# Altium project Current Loop.PrjPcb
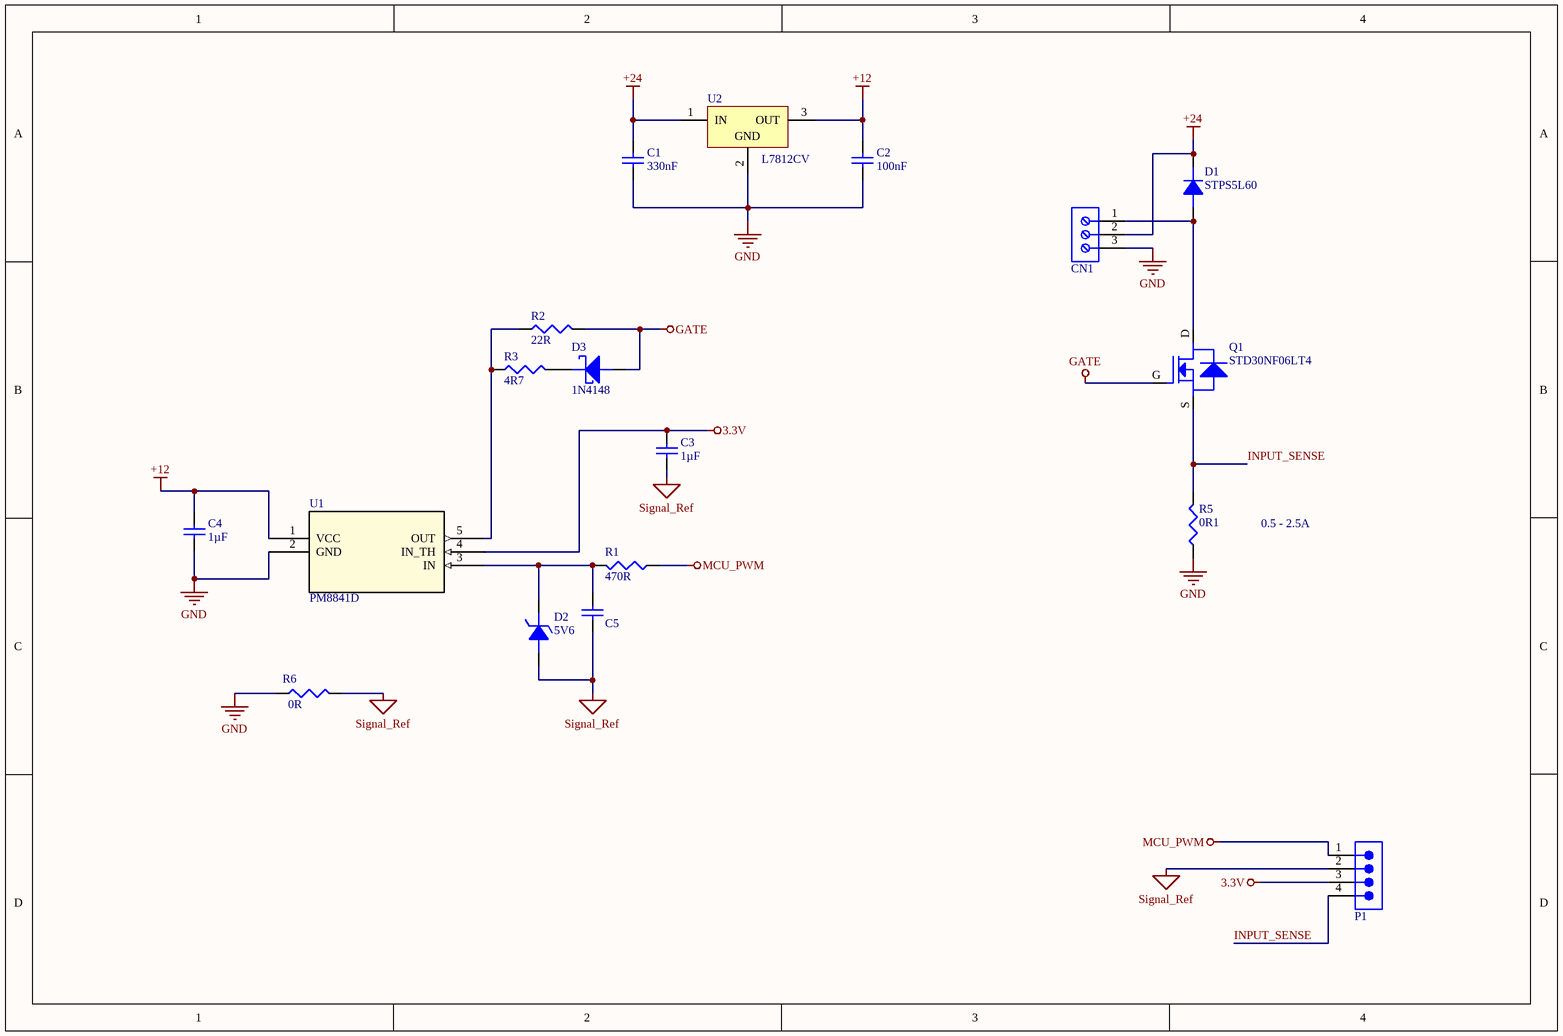
[diagram p0: Current Loop.SchDoc]
1 sheet, 18 parts. Net scope: global (net labels, ports and power ports of the same name join across sheets).
Board file: Current Loop PM8841.PcbDoc

## Sheet Current Loop.SchDoc
size A4

### Parts
C1  330nF  [WCAP-CSGP_0805_L2W1.25H1.25]
C2  100nF  [WCAP-CSGP_0805_L2W1.25H0.8_Reflow]
C3  1µF  [WCAP-CSGP_0805_L2W1.25H1.25]
C4  1µF  [WCAP-CSGP_0805_L2W1.25H1.25]
C5  47pF  [WCAP-CSGP_0805_L2W1.25H0.6_Reflow]  (value not drawn)
CN1  691216710003  [691216710003]  (value not drawn)
D1  STPS5L60  [SMB]
D2  5V6  [SOD80]
D3  1N4148  [SMA]
P1  61300411121  [61300411121]  (value not drawn)
Q1  STD30NF06LT4  [NFET_DPAK]
R1  470R  [SM/R_0805]
R2  22R  [SM/R_0805]
R3  4R7  [SM/R_0805]
R5  0R1  [SM/R_2512]
R6  0R  [SM/R_0805]
U1  PM8841D  [SOT23-5_STM]
U2  L7812CV  [TO220]

### Nets
3.3V: C3.2 P1.3 U1.4(IN_TH)
+12: C2.2 C4.2 U1.1(VCC) U2.3(OUT)
+24: C1.2 CN1.2 D1.K(CATHODE) U2.1(IN)
GATE: D3.A Q1.G(GATE) R2.2
GND: C1.1 C2.1 C4.1 CN1.3 R5.1 R6.1 U1.2(GND) U2.2(GND)
MCU_PWM: P1.1 R1.1
Signal_Ref: C3.1 C5.1 D2.A(ANODE) P1.2 R6.2
INPUT_SENSE: P1.4 Q1.S(SOURCE) R5.2
NetC5_2: C5.2 D2.K(CATHODE) R1.2 U1.3(IN)
NetCN1_1: CN1.1 D1.A(ANODE) Q1.D(DRAIN)
NetD3_K: D3.K R3.2
NetR2_1: R2.1 R3.1 U1.5(OUT)

### Notes on the sheet
- 0.5 - 2.5A

### Library data of the parts
C1 = 885012207101: WCAP-CSGP Multilayer Ceramic Chip Capacitor, General Purpose, size 0805, X7R, 330nF, 50VDC; Manufacturer: Wurth Elektronik; Case/Size Code: 0805; Capacitance Tolerance: +/-10%; Dissipation Factor: 3%; Insulation Resistance: 1.5GΩ; Rated Voltage (DC): 50V; Technical Reference: X7R0805334K050DFCT10000; Manufacturer Part Number: 885012207101; Category: Multilayer Ceramic Chip Capacitors; Match Code: WCAP-CSGP; ComponentLink1Description: Website Link; ComponentLink1URL: https://www.we-online.com/redexpert/article/885012207101?ad; ComponentLink2Description: Datasheet Link; ComponentLink2URL: https://www.we-online.com/redexpert/spec/885012207101?ad; Mount: Surface Mount; Operating Temperature Max: 125°C; Operating Temperature Min: -55°C; Packaging: Tape and Reel; Length: 2mm; Width: 1.25mm; Height: 1.25mm; Capacitance: 330nF; Ceramic Type: X7R
C2 = 885012207072: WCAP-CSGP Multilayer Ceramic Chip Capacitor, General Purpose, size 0805, X7R, 100nF, 25VDC; Manufacturer: Wurth Elektronik; Case/Size Code: 0805; Capacitance Tolerance: +/-10%; Dissipation Factor: 3.5%; Insulation Resistance: 5GΩ; Rated Voltage (DC): 25V; Technical Reference: X7R0805104K025DFCT10000; Manufacturer Part Number: 885012207072; Category: Multilayer Ceramic Chip Capacitors; Match Code: WCAP-CSGP; ComponentLink1Description: Website Link; ComponentLink1URL: https://www.we-online.com/redexpert/article/885012207072?ad; ComponentLink2Description: Datasheet Link; ComponentLink2URL: https://www.we-online.com/redexpert/spec/885012207072?ad; Mount: Surface Mount; Operating Temperature Max: 125°C; Operating Temperature Min: -55°C; Packaging: Tape and Reel; Length: 2mm; Width: 1.25mm; Height: 0.8mm; Capacitance: 100nF; Ceramic Type: X7R
C3 C4 = 885012207078: WCAP-CSGP Multilayer Ceramic Chip Capacitor, General Purpose, size 0805, X7R, 1µF, 25VDC; Manufacturer: Wurth Elektronik; Case/Size Code: 0805; Capacitance Tolerance: +/-10%; Dissipation Factor: 5%; Insulation Resistance: 0.5GΩ; Rated Voltage (DC): 25V; Technical Reference: X7R0805105K025DFCT10000; Manufacturer Part Number: 885012207078; Category: Multilayer Ceramic Chip Capacitors; Match Code: WCAP-CSGP; ComponentLink1Description: Website Link; ComponentLink1URL: https://www.we-online.com/redexpert/article/885012207078?ad; ComponentLink2Description: Datasheet Link; ComponentLink2URL: https://www.we-online.com/redexpert/spec/885012207078?ad; Mount: Surface Mount; Operating Temperature Max: 125°C; Operating Temperature Min: -55°C; Packaging: Tape and Reel; Length: 2mm; Width: 1.25mm; Height: 1.25mm; Capacitance: 1µF; Ceramic Type: X7R
C5 = 885012007032: WCAP-CSGP Multilayer Ceramic Chip Capacitor, General Purpose, size 0805, NP0, 47pF, 25VDC; Manufacturer: Wurth Elektronik; Case/Size Code: 0805; Capacitance Tolerance: +/-5%; Insulation Resistance: 10GΩ; Q Factor: 1000; Rated Voltage (DC): 25V; Technical Reference: NP00805470J025DFCT10000; Manufacturer Part Number: 885012007032; Category: Multilayer Ceramic Chip Capacitors; Match Code: WCAP-CSGP; ComponentLink1Description: Website Link; ComponentLink1URL: https://www.we-online.com/redexpert/article/885012007032?ad; ComponentLink2Description: Datasheet Link; ComponentLink2URL: https://www.we-online.com/redexpert/spec/885012007032?ad; Mount: Surface Mount; Operating Temperature Max: 125°C; Operating Temperature Min: -55°C; Packaging: Tape and Reel; Length: 2mm; Width: 1.25mm; Height: 0.6mm; Capacitance: 47pF; Ceramic Type: NP0
CN1 = 691216710003: WR-TBL Serie 2167 Horizontal Entry Modular, Rising Cage Clamp, pitch 5mm, 3p; Compliance: Lead free / RoHS;​ ROHS & Reach; Modularity: Yes; PCB/Cable/Panel: PCB; Pin Number: 3; Rated Current [UL]: 14A; Working Voltage [UL]: 300VAC; ComponentLink1Description: Manufacturer; ComponentLink1URL: http://www.we-online.de; ComponentLink2URL: https://katalog.we-online.de/em/datasheet/691216710003.pdf; ComponentLink2Description: Datasheet; Mounting Technology: THT; Part Number: 691216710003; Packaging: Box; Operating Temperature: -30 to +120degC; Pitch: 5mm; Published Date: October 2019; Type: Horizontal; Publisher: Wurth Elektronik; Application: Rising Cage Clamp
D1 = SMB: Manufacturer: STMicroelectronics
D2 = SOD80_zener
D3 = SMA_Schottky: Value/Generic Part Number: Schottky Diode; Package/Class: SM
P1 = 61300411121: WR-PHD Pin Header, THT, Vertical, pitch 2.54mm, 1 Row, 4P; Manufacturer: Wurth Elektronik; Contact Resistance: 20mΩ; Rated Current: 3A; Working Voltage: 250V; Withstanding Voltage: 500V; ComponentLink1Description: Website Link; ComponentLink1URL: https://www.we-online.com/redexpert/article/61300411121?ad; ComponentLink2Description: Datasheet Link; ComponentLink2URL: https://www.we-online.com/redexpert/spec/61300411121?ad; Manufacturer Part Number: 61300411121; Category: Board-to-Board Connectors; Match Code: WR-PHD; Mount: Through Hole; Operating Temperature Max: 105°C; Operating Temperature Min: -40°C; Packaging: Bag; Gender: Pin Header; Number of Pins: 4; Number of Rows: 1; Orientation: Vertical; Pitch: 2.54mm
Q1 = NFET: Manufacturer: STMicroelectronics; Package/Class: SM; Mfg P/N: NFET_D2PAK; Value/Generic Part Number: NFET_DPAK
R1-R3 R5 R6 = SMRes: Mounting: SMD
  R1-R3 R6: RoHS: Yes; Category: Chip SMD Resistors; Stock 1: 1; Pricing 1: 10=0.67400, 100=0.52000, 250=0.49300, 500=0.33100, 1000=0.28900 (USD); Mount: Surface Mount; Number of Pins: 2; Resistor Type: FIXED RESISTOR
U1 = PM8841D: No Description Available; Mfr_Name: STMicroelectronics; RefDes: RefDes; Type: Type
U2 = CMP-0244-00450-1: Positive Voltage Regulator, 12V, 3-Pin TO-220; PackageDescription: TO, Thru-Hole, Vertical, Heatsink Mounted; 3 In-Line Leads; Pitch 2.54 mm; ComponentLink3URL: http://www.st.com/internet/com/TECHNICAL_RESOURCES/TECHNICAL_LITERATURE/PACKAGE_INFORMATION/CD00004649.pdf; ComponentLink1URL: http://www.st.com; ComponentLink2Description: Datasheet; ComponentLink3Description: Package Specification; ComponentLink2URL: http://www.st.com/internet/com/TECHNICAL_RESOURCES/TECHNICAL_LITERATURE/DATASHEET/CD00000444.pdf; DatasheetVersion: 16/11/2011; PackageVersion: ver3.0; PackageReference: TO220; ComponentLink1Description: Manufacturer URL